# EAGLE design preScale-Mb501 (EAGLE 5.07)
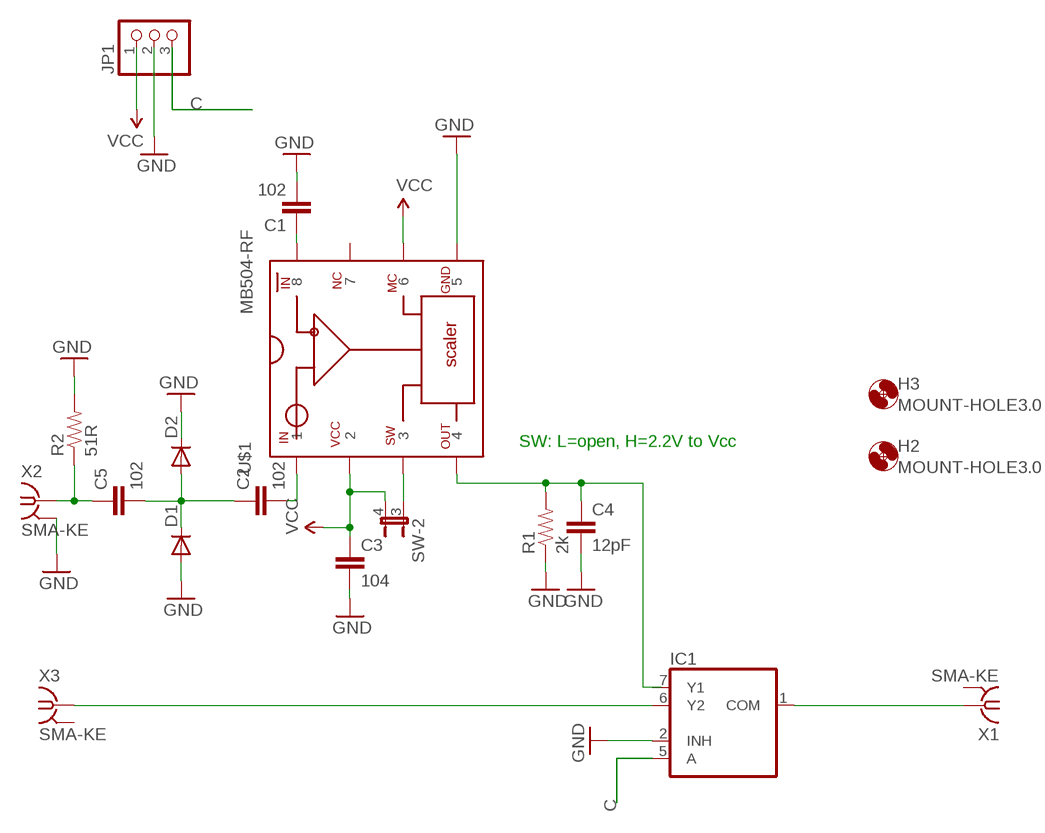
[diagram p0: schematic, sheet 1]

## Parts
C1  102  CAP-C0805  [C0805]
C2  102  CAP-C0805  [C0805]
C3  104  CAP-C0805  [C0805]
C4  12pF  CAP-C0805  [C0805]
C5  102  CAP-C0805  [C0805]
D1  DIODE1206  [1206-DIODE]
D2  DIODE1206  [1206-DIODE]
H2  MOUNT-HOLE3.0  [3,0]
H3  MOUNT-HOLE3.0  [3,0]
IC1  2G53  741G53DCU  [DCU_R-PDSO-G8]
JP1  PINHD-1X3PTH  [1X03]
R1  2k  RESISTOR0805  [0805]
R2  51R  RESISTOR0805  [0805]
SW  JP2QE-2X2  [JP2Q]
U$1  MB504-RF  [DIP8-RF]
X1  SMA-KE  SMA-142-0711-821/826  [J502-ND-142-0711-821/826]
X2  SMA-KE  SMA-142-0711-821/826  [J502-ND-142-0711-821/826]
X3  SMA-KE  SMA-142-0711-821/826  [J502-ND-142-0711-821/826]

## Nets
C: IC1.5(A) JP1.3
GND: C1.2 C3.2 C4.2 D1.A D2.K(C) IC1.2(INH) JP1.2 R1.1 R2.2 U$1.P$5 X2.G@1(GND)
N$1: C1.1 U$1.P$8
N$2: C2.2 U$1.P$1
N$3: C2.1 C5.2 D1.K(C) D2.A
N$4: C4.1 R1.2 U$1.P$4
N$5: C5.1 R2.1 X2.1
N$6: IC1.1(COM) X1.1
N$7: SW.3 U$1.P$3
N$8: IC1.6(Y2) X3.1
VCC: C3.1 JP1.1 SW.4 U$1.P$2 U$1.P$6
Unconnected: IC1.7(Y1) SW.1 SW.2 U$1.P$7

## Notes on the sheet
- SW: L=open, H=2.2V to Vcc

## Power pins joined to a net without a drawn wire
GND: IC1.3(GND) IC1.4(GND) X1.G@1(GND) X1.G@2(GND) X1.G@3(GND) X1.G@4(GND) X2.G@2(GND) X2.G@3(GND) X2.G@4(GND) X3.G@1(GND) X3.G@2(GND) X3.G@3(GND) X3.G@4(GND)
VCC: IC1.8(VCC)

## Library data of the parts
C1-C5 = digital-toy:CAP: Capacitor Standard 0603 ceramic capacitor, and 0.1" leaded capacitor.
D1 D2 = digital-toy:DIODE: Diode These are standard reverse protection diodes and small signal diodes. SMA package can handle up to about 1A. SOD-323 can handle about 200mA. What the SOD-323 package when ordering, there are some mfgs out there that are 5-pin packages.
H2 H3 = holes:MOUNT-HOLE: MOUNTING HOLE with drill center marker
IC1 = 74xx-little-de:74*1G53: SINGLE-POLE DOUBLE-THROW (SPDT) ANALOG SWITCH 2:1 ANALOG MULTIPLEXER/DEMULTIPLEXER Source: http://focus.ti.com/lit/ds/symlink/sn74lvc2g53.pdf
JP1 = digital-toy:PINHD-1X3: PIN HEADER
R1 R2 = digital-toy:RESISTOR: Resistor Basic schematic elements and footprints for 0603, 1206, and PTH 1/10th watt (small) resistors. digital-toy copy vertical mount of axial-0.3 from rcl.lbr : the 0207/xx
SW = digital-toy:JP2QE: JUMPER
U$1 = dtoy-RF:MB504: MB501/504 by hyl 2011.4.8
X1-X3 = con-coax:SMA-: SMA 50 Ohm End Launch Jack Receptacle - Round Contact Johnson Components Source: www.johnsoncomponents.com .. J502-ND.pdf

## Board
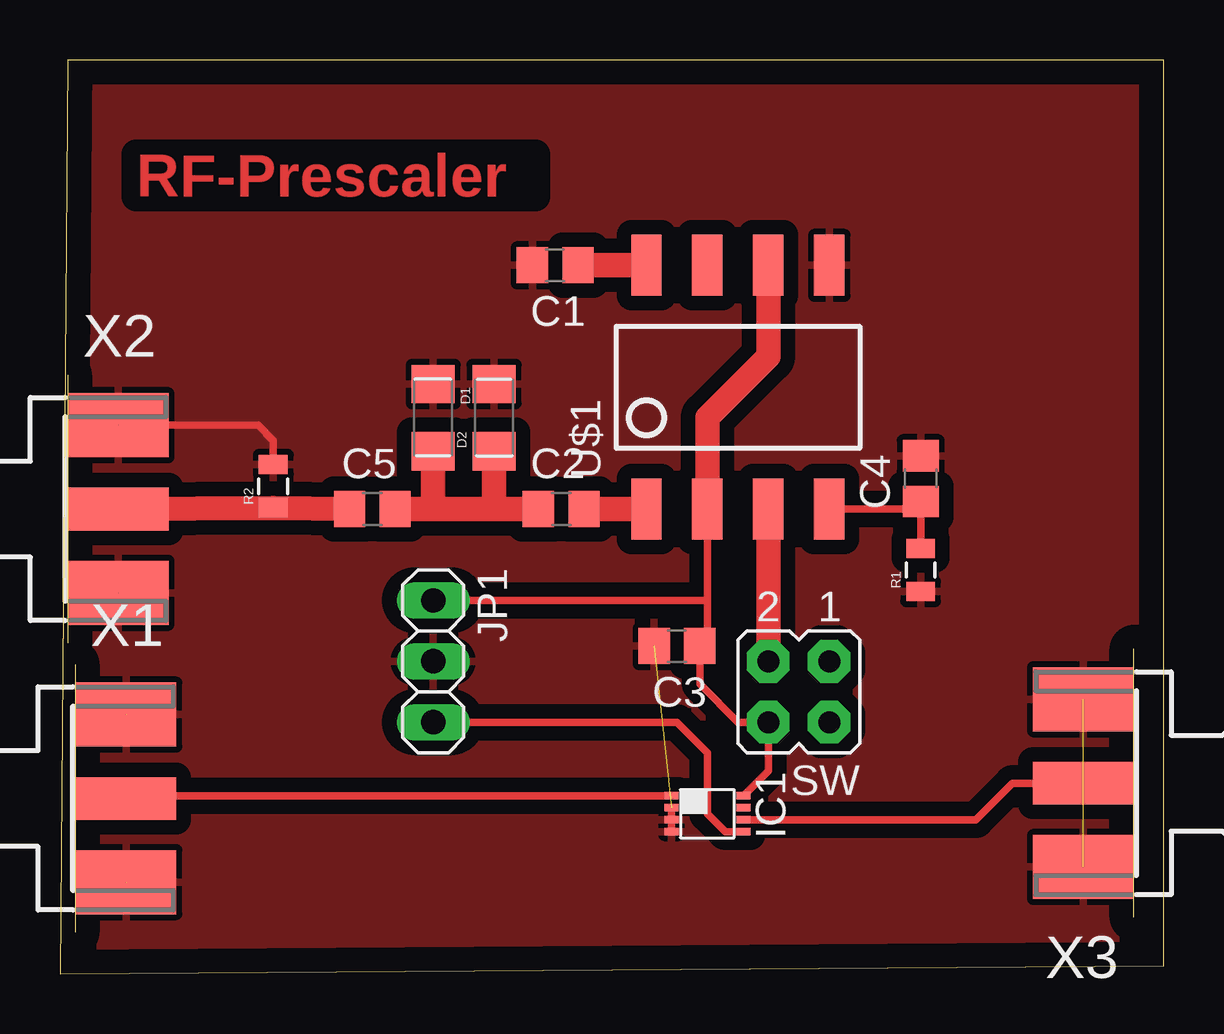
[diagram p1: board, top side]
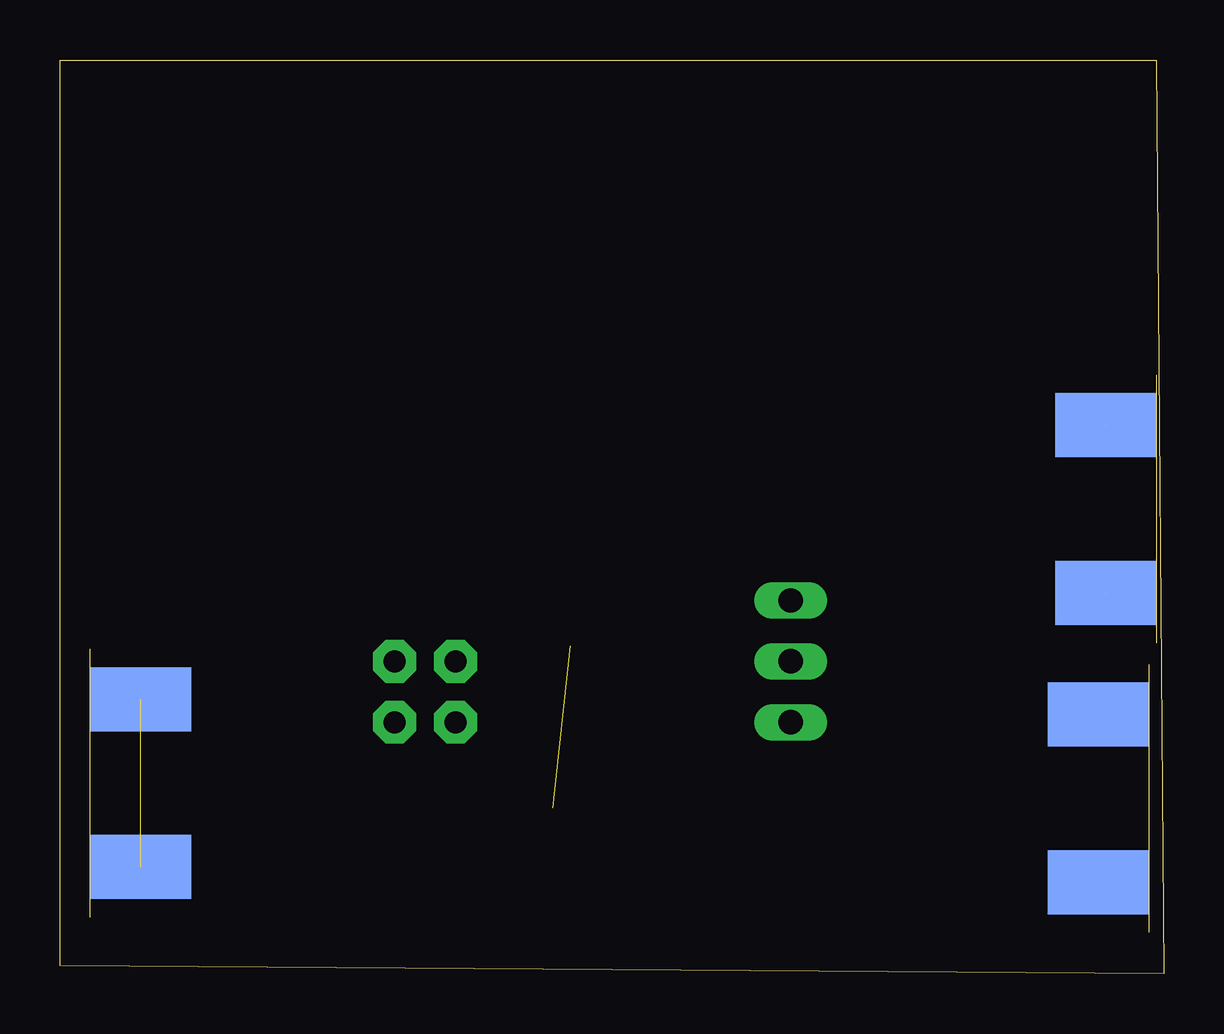
[diagram p2: board, bottom side, seen from below]

Size 46.02 x 38.09 mm. Coordinates in mm from the lower left corner, seen from the top.
Outline: 0,0 46.02,0.32 46.02,38.09 0.32,38.09 0,0
Copper layers (1*16): Top 0.035mm / dielectric 1.5mm / Bottom 0.035mm
Design rules "default": minimum track width 10mil, minimum drill 24mil, track to track 8mil, track to pad 8mil, pad to pad 8mil, via to via 8mil, smd to smd 8mil, copper to edge 40mil, drill to drill 8mil, minimum pad ring 10mil, minimum via ring 8mil, stop-mask expansion 4mil, vias tented up to drill 0mil, thermal gap 10mil

### Footprints (pad centres in the part's own frame; a part is rotated, then mirrored left to right if it is on the bottom)
C0805 = smd 1.3 x 1.5: 1 -0.95,0; 2 0.95,0
1206-DIODE = smd 1.6 x 1.8: A -1.4,0; K 1.4,0
DCU_R-PDSO-G8 = smd 0.3 x 0.6: 1 -0.75,-1.5; 2 -0.25,-1.5; 3 0.25,-1.5; 4 0.75,-1.5; 5 0.75,1.5; 6 0.25,1.5; 7 -0.25,1.5; 8 -0.75,1.5
1X03 = drill 1.016 long: 1 -2.54,0; 2 0,0; 3 2.54,0
0805 = smd 0.8 x 1.2: 1 -0.9,0; 2 0.9,0
JP2Q = drill 0.914 pad 1.778 octagon: 1 -1.27,-1.27; 2 -1.27,1.27; 3 1.27,-1.27; 4 1.27,1.27
DIP8-RF = smd 1.27 x 2.54: P$1 0,-3.81; P$2 2.54,-3.81; P$3 5.08,-3.81; P$4 7.62,-3.81; P$5 7.62,6.35; P$6 5.08,6.35; P$7 2.54,6.35; P$8 0,6.35
J502-ND-142-0711-821/826 = smd 4.191 x 1.778: 1 2.115,0 | smd 4.191 x 2.667: G@1 2.115,3.495; G@2 2.115,-3.495 | smd 4.191 x 2.667 bottom: G@3 2.115,3.495; G@4 2.115,-3.495

### Placement (x,y rotation side)
C1  20.64,29.53 180 top
C2  20.89,19.37 0 top
C3  25.72,13.65 180 top
C4  35.88,20.64 90 top
C5  13.02,19.37 0 top
D1  15.56,23.18 270 top
D2  18.1,23.18 90 top
IC1  741G53DCU  [DCU_R-PDSO-G8]  26.99,6.67 270 top
JP1  15.56,13.02 270 top
R1  35.88,16.83 90 top
R2  8.89,20.32 90 top
SW  30.8,11.75 180 top
U$1  24.45,23.18 0 top
X1  SMA-142-0711-821/826  [J502-ND-142-0711-821/826]  0.63,7.3 0 top
X2  SMA-142-0711-821/826  [J502-ND-142-0711-821/826]  0.32,19.37 0 top
X3  SMA-142-0711-821/826  [J502-ND-142-0711-821/826]  44.77,7.94 180 top

### Tracks (layer width: path | path; a pad name or v marks a point on that pad's centre or on a via)
C
  Top 0.305: IC1.5 27.74,5.92 26.99,6.67 26.99,9.21 25.72,10.48 JP1.3
GND  (8 unrouted)
  Top 0.305: IC1.2 IC1.3 IC1.4 | X2.G@3 8.25,22.86 8.89,22.22 R2.2
  pour Top (isolate 0.61): 55.88,53.97 73.34,30.16 72.71,9.21 71.76,-17.46 61.28,-36.19 -21.59,-34.29 -30.8,37.47 1.9,54.61
N$1
  Top 1.016: C1.1 U$1.P$8
N$2
  Top 1.016: C2.2 U$1.P$1
N$3
  Top 1.016: C5.2 15.56,19.37 | 15.56,19.37 18.1,19.37 | 18.1,19.37 C2.1 | 15.56,19.37 D1.K | 18.1,19.37 D2.A
N$4
  Top 0.305: U$1.P$4 35.56,19.37 C4.1 R1.2
N$5
  Top 1.016: C5.1 R2.1 X2.1
N$6
  Top 0.305: IC1.1 2.87,7.42 arc90 X1.1
N$7
  Top 1.016: SW.3 U$1.P$3
N$8
  Top 0.305: IC1.6 38.17,6.42 39.69,7.94 X3.1
VCC
  Top 0.305: IC1.8 29.53,8.46 SW.4 28.26,10.48 26.67,12.07 C3.1 26.99,13.97 26.99,15.56 | JP1.1 26.99,15.56 | 26.99,15.56 U$1.P$2
  Top 1.016: U$1.P$2 26.99,23.18 29.53,25.72 U$1.P$6

### Text on the board
Top: RF-Prescaler